# Altium project Concentrador-Modbus.PrjPcb (part 2 of 3)
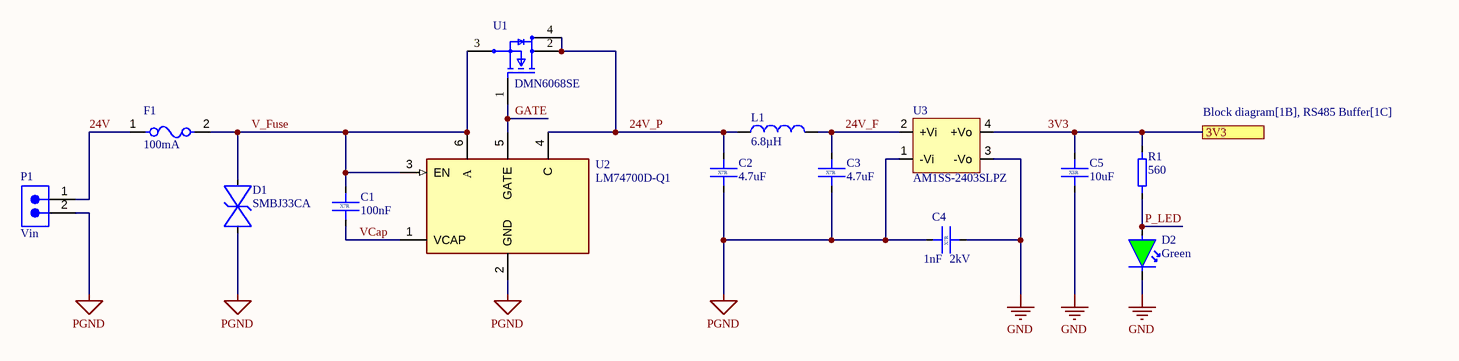
[diagram p3: PSU.SchDoc]

## Sheet PSU.SchDoc: POWER SUPPLY (continued)
### Library data of the parts
C1 = 06035C104JAT2A: 0603 100 nF 50 V ±5 % Tolerance X7R SMT MLCC; Manufacturer: KYOCERA AVX; Dielectric Material: Ceramic; Tolerance: 5%; Voltage: 50V; Supplier: TME; Supplier Part Number: 06035C104JAT2A; Manufacturer Part Number: 06035C104JAT2A; RoHS: Compliant; Category: Ceramic Capacitors; Stock: 65414; Pricing: 1=0,02486, 10=0,02212, 100=0,0145, 500=0,00951, 1000=0,00801, 4000=0,00598, 8000=0,00531, 12000=0,005, 20000=0,00468, 40000=0,00453 (EUR); Value: 100nF; Case/Package: 0603; Case Code (Imperial): 0603; Case Code (Metric): 1608; China RoHS: Compliant; Contact Plating: Tin; Depth: 810µm; Height: 940µm; Lead Free: Lead Free; Length: 1.6mm; Lifecycle Status: Production; Material: Ceramic; Max Operating Temperature: 125°C; Min Operating Temperature: -55°C; Mounting Technology: Surface Mount; Pins: 2; Number of Terminals: 2; Packaging: Cut Tape; Radiation Hardening: No; REACH SVHC: Yes; Schedule B: 8532240020; Termination: SMD/SMT; Thickness: 889µm; Voltage Rating: 50V; Voltage Rating (DC): 50V; Width: 810µm; ComponentLink1URL: https://datasheet.octopart.com:443/06035C104JAT2A-KYOCERA-AVX-datasheet-170560559.pdf?src-supplier=IHS; ComponentLink1Description: https://datasheet.octopart.com:443/06035C104JAT2A-KYOCERA-AVX-datasheet-170560559.pdf?src-supplier=IHS; ComponentLink2URL: https://datasheet.octopart.com:443/06035C104JAT2A-AVX-datasheet-26446220.pdf?src-supplier=Upverter; ComponentLink2Description: https://datasheet.octopart.com:443/06035C104JAT2A-AVX-datasheet-26446220.pdf?src-supplier=Upverter; ComponentLink3URL: https://sigma.octopart.com:443/147443767/technical_drawing/AVX-06035C104JAT2A.pdf?src-supplier=Upverter; ComponentLink3Description: https://sigma.octopart.com:443/147443767/technical_drawing/AVX-06035C104JAT2A.pdf?src-supplier=Upverter; ComponentLink4URL: https://datasheet.octopart.com:443/06035C104JAT2A-AVX-datasheet-12587061.pdf?src-supplier=element14+APAC; ComponentLink4Description: https://datasheet.octopart.com:443/06035C104JAT2A-AVX-datasheet-12587061.pdf?src-supplier=element14+APAC; ComponentLink5URL: https://datasheet.octopart.com:443/06035C104JAT2A-AVX-datasheet-12509786.pdf?src-supplier=element14+APAC; ComponentLink5Description: https://datasheet.octopart.com:443/06035C104JAT2A-AVX-datasheet-12509786.pdf?src-supplier=element14+APAC; ComponentLink6URL: https://datasheet.octopart.com:443/06035C104JAT2A-KYOCERA-AVX-datasheet-158983632.pdf?src-supplier=Newark; ComponentLink6Description: https://datasheet.octopart.com:443/06035C104JAT2A-KYOCERA-AVX-datasheet-158983632.pdf?src-supplier=Newark; ComponentLink7URL: https://datasheet.octopart.com:443/06035C104JAT2A-AVX-datasheet-78690206.pdf?src-supplier=Newark; ComponentLink7Description: https://datasheet.octopart.com:443/06035C104JAT2A-AVX-datasheet-78690206.pdf?src-supplier=Newark; ComponentLink8URL: https://datasheet.octopart.com:443/06035C104JAT2A-KYOCERA-AVX-datasheet-65931687.pdf?src-supplier=Newark; ComponentLink8Description: https://datasheet.octopart.com:443/06035C104JAT2A-KYOCERA-AVX-datasheet-65931687.pdf?src-supplier=Newark; ComponentLink9URL: https://datasheet.octopart.com:443/06035C104JAT2A-AVX-datasheet-8113618.pdf?src-supplier=Factory+Futures; ComponentLink9Description: https://datasheet.octopart.com:443/06035C104JAT2A-AVX-datasheet-8113618.pdf?src-supplier=Factory+Futures; ComponentLink10URL: https://datasheet.octopart.com:443/06035C104JAT2A-AVX-datasheet-5313617.pdf?src-supplier=Factory+Futures; ComponentLink10Description: https://datasheet.octopart.com:443/06035C104JAT2A-AVX-datasheet-5313617.pdf?src-supplier=Factory+Futures; ComponentLink11URL: https://datasheet.octopart.com:443/06035C104JAT2A-AVX-datasheet-167033.pdf?src-supplier=Factory+Futures; ComponentLink11Description: https://datasheet.octopart.com:443/06035C104JAT2A-AVX-datasheet-167033.pdf?src-supplier=Factory+Futures; ComponentLink12URL: https://datasheet.octopart.com:443/06035C104JAT2A-AVX-datasheet-166051239.pdf?src-supplier=Amar+Radio+Corporation; ComponentLink12Description: https://datasheet.octopart.com:443/06035C104JAT2A-AVX-datasheet-166051239.pdf?src-supplier=Amar+Radio+Corporation; ComponentLink13URL: https://datasheet.octopart.com:443/06035C104JAT2A-KYOCERA-AVX-datasheet-156093841.pdf?src-supplier=TME; ComponentLink13Description: https://datasheet.octopart.com:443/06035C104JAT2A-KYOCERA-AVX-datasheet-156093841.pdf?src-supplier=TME; ComponentLink14URL: https://datasheet.octopart.com:443/06035C104JAT2A-AVX---Kyocera-datasheet-8446237.pdf?src-supplier=TME; ComponentLink14Description: https://datasheet.octopart.com:443/06035C104JAT2A-AVX---Kyocera-datasheet-8446237.pdf?src-supplier=TME; ComponentLink15URL: https://datasheet.octopart.com:443/06035C104JAT2A-KYOCERA-AVX-datasheet-50865067.pdf?src-supplier=Future+Electronics; ComponentLink15Description: https://datasheet.octopart.com:443/06035C104JAT2A-KYOCERA-AVX-datasheet-50865067.pdf?src-supplier=Future+Electronics; ComponentLink16URL: https://datasheet.octopart.com/06035C104JAT2A-AVX---Kyocera-datasheet-13516023.pdf; ComponentLink16Description: https://datasheet.octopart.com/06035C104JAT2A-AVX---Kyocera-datasheet-13516023.pdf; ComponentLink17URL: https://datasheet.octopart.com:443/06035C104JAT2A-AVX-datasheet-11546901.pdf?src-supplier=Arrow+Electronics; ComponentLink17Description: https://datasheet.octopart.com:443/06035C104JAT2A-AVX-datasheet-11546901.pdf?src-supplier=Arrow+Electronics; ComponentLink18URL: https://datasheet.octopart.com:443/06035C104JAT2A-AVX-datasheet-4352.pdf?src-supplier=RS+(Formerly+Allied+Electronics); ComponentLink18Description: https://datasheet.octopart.com:443/06035C104JAT2A-AVX-datasheet-4352.pdf?src-supplier=RS+(Formerly+Allied+Electronics); ComponentLink19URL: http://sigma.octopart.com:80/reach_statement/AVX-company-19.pdf?src-supplier=Compliance+Statements; ComponentLink19Description: http://sigma.octopart.com:80/reach_statement/AVX-company-19.pdf?src-supplier=Compliance+Statements; ComponentLink20URL: http://sigma.octopart.com:80/conflict_mineral_statement/AVX-company-34.pdf?src-supplier=Compliance+Statements; ComponentLink20Description: http://sigma.octopart.com:80/conflict_mineral_statement/AVX-company-34.pdf?src-supplier=Compliance+Statements
C2 C3 = 12065C475K4Z2A: 1206 4.7 uF 50 V ±10 % Tolerance X7R SMT MLCC; Manufacturer: KYOCERA AVX; Dielectric Material: Ceramic; Tolerance: 10%; Voltage Rating: 50V; Supplier: TME; Supplier Part Number: 12065C475K4Z2A; Manufacturer Part Number: 12065C475K4Z2A; RoHS: Compliant; Category: Ceramic Capacitors; Stock: 2656; Pricing: 1=0,426, 10=0,253, 100=0,206, 500=0,152, 1000=0,131, 2000=0,12, 4000=0,117, 6000=0,114, 10000=0,113 (EUR); Value: 4.7uF; Case/Package: 1206; China RoHS: Compliant; Height: 1.78mm; Length: 3.2mm; Lifecycle Status: Production; Material: Ceramic; Max Operating Temperature: 125°C; Min Operating Temperature: -55°C; Mounting Technology: Surface Mount; Number of Terminals: 2; REACH SVHC: Yes; Schedule B: 8532240020; Voltage Rating (DC): 50V; Width: 1.6mm; ComponentLink1URL: https://datasheet.octopart.com:443/12065C475K4Z2A-KYOCERA-AVX-datasheet-172544266.pdf?src-supplier=IHS; ComponentLink1Description: https://datasheet.octopart.com:443/12065C475K4Z2A-KYOCERA-AVX-datasheet-172544266.pdf?src-supplier=IHS; ComponentLink2URL: https://datasheet.octopart.com:443/12065C475K4Z2A-KYOCERA-AVX-datasheet-170607686.pdf?src-supplier=Newark; ComponentLink2Description: https://datasheet.octopart.com:443/12065C475K4Z2A-KYOCERA-AVX-datasheet-170607686.pdf?src-supplier=Newark; ComponentLink3URL: https://datasheet.octopart.com:443/12065C475K4Z2A-KYOCERA-AVX-datasheet-101604984.pdf?src-supplier=Farnell; ComponentLink3Description: https://datasheet.octopart.com:443/12065C475K4Z2A-KYOCERA-AVX-datasheet-101604984.pdf?src-supplier=Farnell; ComponentLink4URL: https://datasheet.octopart.com:443/12065C475K4Z2A-KYOCERA-AVX-datasheet-156093842.pdf?src-supplier=Future+Electronics; ComponentLink4Description: https://datasheet.octopart.com:443/12065C475K4Z2A-KYOCERA-AVX-datasheet-156093842.pdf?src-supplier=Future+Electronics; ComponentLink5URL: https://datasheet.octopart.com:443/12065C475K4Z2A-KYOCERA-AVX-datasheet-156093841.pdf?src-supplier=TME; ComponentLink5Description: https://datasheet.octopart.com:443/12065C475K4Z2A-KYOCERA-AVX-datasheet-156093841.pdf?src-supplier=TME; ComponentLink6URL: https://datasheet.octopart.com:443/12065C475K4Z2A-AVX-datasheet-151020609.pdf?src-supplier=LKR; ComponentLink6Description: https://datasheet.octopart.com:443/12065C475K4Z2A-AVX-datasheet-151020609.pdf?src-supplier=LKR; ComponentLink7URL: https://datasheet.octopart.com/12065C475K4Z2A-KYOCERA-AVX-datasheet-13516023.pdf; ComponentLink7Description: https://datasheet.octopart.com/12065C475K4Z2A-KYOCERA-AVX-datasheet-13516023.pdf; ComponentLink8URL: http://sigma.octopart.com:80/reach_statement/AVX-company-19.pdf?src-supplier=Compliance+Statements; ComponentLink8Description: http://sigma.octopart.com:80/reach_statement/AVX-company-19.pdf?src-supplier=Compliance+Statements; ComponentLink9URL: http://sigma.octopart.com:80/conflict_mineral_statement/AVX-company-34.pdf?src-supplier=Compliance+Statements; ComponentLink9Description: http://sigma.octopart.com:80/conflict_mineral_statement/AVX-company-34.pdf?src-supplier=Compliance+Statements
C4 = CC1206KKX7RDBB102: 1210 1 nF 2 kV ±10 % Tolerance X7R SMT MLCC; Manufacturer: Yageo Group; Dielectric Material: Ceramic; Dissipation Factor: 2.5%; Insulation Resistance: 10GΩ; Tolerance: 10%; Supplier: TME; Supplier Part Number: CC1206KKX7RDBB102; Manufacturer Part Number: CC1206KKX7RDBB102; RoHS: Compliant; Category: Ceramic Capacitors; Stock: 17400; Pricing: 1=0,1, 10=0,0533, 50=0,0349, 100=0,0259, 500=0,0199, 1000=0,0185, 3000=0,0179, 6000=0,0175, 9000=0,0172, 15000=0,0169 (EUR); Value: 1nF; Case/Package: 1206; Case Code (Imperial): 1206; Case Code (Metric): 3216; China RoHS: Compliant; Composition: Ceramic; Depth: 1.6mm; Height: 1.25mm; Lead Free: Lead Free; Length: 3.2mm; Lifecycle Status: Production; Material: Ceramic; Max Operating Temperature: 125°C; Min Operating Temperature: -55°C; Mounting Technology: Surface Mount; Pins: 2; Number of Terminals: 2; Radiation Hardening: No; REACH SVHC: Unaffected; Schedule B: 8532240020, 8532240020|8532240020|8532240020|8532240020|8532240020|8532240020|8532240020|8532240020|8532240020|8532240020|8532240020|8532240020|8532240020|8532240020|8532240020|8532240020|8532240020|8532240020|8532240020|8532240020|8532240020|8532240020|8532240020|85; Termination: SMD/SMT; Thickness: 1.4478mm; Voltage Rating: 2kV; Voltage Rating (DC): 2kV; Width: 1.6mm; ComponentLink1URL: https://datasheet.octopart.com:443/CC1206KKX7RDBB102-Yageo-datasheet-182140686.pdf?src-supplier=IHS; ComponentLink1Description: https://datasheet.octopart.com:443/CC1206KKX7RDBB102-Yageo-datasheet-182140686.pdf?src-supplier=IHS; ComponentLink2URL: https://datasheet.octopart.com:443/CC1206KKX7RDBB102-Yageo-datasheet-151869847.pdf?src-supplier=Upverter; ComponentLink2Description: https://datasheet.octopart.com:443/CC1206KKX7RDBB102-Yageo-datasheet-151869847.pdf?src-supplier=Upverter; ComponentLink3URL: https://sigma.octopart.com:443/147830939/technical_drawing/Yageo-CC1206KKX7RDBB102.pdf?src-supplier=Upverter; ComponentLink3Description: https://sigma.octopart.com:443/147830939/technical_drawing/Yageo-CC1206KKX7RDBB102.pdf?src-supplier=Upverter; ComponentLink4URL: https://datasheet.octopart.com:443/CC1206KKX7RDBB102-Yageo-datasheet-49299170.pdf?src-supplier=element14+APAC; ComponentLink4Description: https://datasheet.octopart.com:443/CC1206KKX7RDBB102-Yageo-datasheet-49299170.pdf?src-supplier=element14+APAC; ComponentLink5URL: https://datasheet.octopart.com:443/CC1206KKX7RDBB102-Yageo-datasheet-13436831.pdf?src-supplier=element14+APAC; ComponentLink5Description: https://datasheet.octopart.com:443/CC1206KKX7RDBB102-Yageo-datasheet-13436831.pdf?src-supplier=element14+APAC; ComponentLink6URL: https://datasheet.octopart.com:443/CC1206KKX7RDBB102-Yageo-datasheet-181970793.pdf?src-supplier=Newark; ComponentLink6Description: https://datasheet.octopart.com:443/CC1206KKX7RDBB102-Yageo-datasheet-181970793.pdf?src-supplier=Newark; ComponentLink7URL: https://datasheet.octopart.com:443/CC1206KKX7RDBB102-Yageo-datasheet-181970792.pdf?src-supplier=Newark; ComponentLink7Description: https://datasheet.octopart.com:443/CC1206KKX7RDBB102-Yageo-datasheet-181970792.pdf?src-supplier=Newark; ComponentLink8URL: https://datasheet.octopart.com:443/CC1206KKX7RDBB102-Yageo-datasheet-11521487.pdf?src-supplier=Newark; ComponentLink8Description: https://datasheet.octopart.com:443/CC1206KKX7RDBB102-Yageo-datasheet-11521487.pdf?src-supplier=Newark; ComponentLink9URL: https://datasheet.octopart.com:443/CC1206KKX7RDBB102-Yageo-datasheet-8324504.pdf?src-supplier=Newark; ComponentLink9Description: https://datasheet.octopart.com:443/CC1206KKX7RDBB102-Yageo-datasheet-8324504.pdf?src-supplier=Newark; ComponentLink10URL: https://datasheet.octopart.com:443/CC1206KKX7RDBB102-Yageo-datasheet-159543404.pdf?src-supplier=Newark; ComponentLink10Description: https://datasheet.octopart.com:443/CC1206KKX7RDBB102-Yageo-datasheet-159543404.pdf?src-supplier=Newark; ComponentLink11URL: https://datasheet.octopart.com:443/CC1206KKX7RDBB102-Yageo-Group-datasheet-192360828.pdf?src-supplier=Future+Electronics; ComponentLink11Description: https://datasheet.octopart.com:443/CC1206KKX7RDBB102-Yageo-Group-datasheet-192360828.pdf?src-supplier=Future+Electronics; ComponentLink12URL: https://datasheet.octopart.com:443/CC1206KKX7RDBB102-Yageo-datasheet-169726300.pdf?src-supplier=Future+Electronics; ComponentLink12Description: https://datasheet.octopart.com:443/CC1206KKX7RDBB102-Yageo-datasheet-169726300.pdf?src-supplier=Future+Electronics; ComponentLink13URL: https://datasheet.octopart.com:443/CC1206KKX7RDBB102-Yageo-datasheet-137700082.pdf?src-supplier=Future+Electronics; ComponentLink13Description: https://datasheet.octopart.com:443/CC1206KKX7RDBB102-Yageo-datasheet-137700082.pdf?src-supplier=Future+Electronics; ComponentLink14URL: https://datasheet.octopart.com:443/CC1206KKX7RDBB102-Yageo-datasheet-137700086.pdf?src-supplier=Future+Electronics; ComponentLink14Description: https://datasheet.octopart.com:443/CC1206KKX7RDBB102-Yageo-datasheet-137700086.pdf?src-supplier=Future+Electronics; ComponentLink15URL: https://datasheet.octopart.com:443/CC1206KKX7RDBB102-Yageo-datasheet-137700084.pdf?src-supplier=Future+Electronics; ComponentLink15Description: https://datasheet.octopart.com:443/CC1206KKX7RDBB102-Yageo-datasheet-137700084.pdf?src-supplier=Future+Electronics; ComponentLink16URL: https://datasheet.octopart.com:443/CC1206KKX7RDBB102-Yageo-datasheet-26579250.pdf?src-supplier=Future+Electronics; ComponentLink16Description: https://datasheet.octopart.com:443/CC1206KKX7RDBB102-Yageo-datasheet-26579250.pdf?src-supplier=Future+Electronics; ComponentLink17URL: https://datasheet.octopart.com:443/CC1206KKX7RDBB102-Yageo-Group-datasheet-194267568.pdf?src-supplier=LCSC; ComponentLink17Description: https://datasheet.octopart.com:443/CC1206KKX7RDBB102-Yageo-Group-datasheet-194267568.pdf?src-supplier=LCSC; ComponentLink18URL: https://datasheet.octopart.com:443/CC1206KKX7RDBB102-Yageo-datasheet-151948686.pdf?src-supplier=TME; ComponentLink18Description: https://datasheet.octopart.com:443/CC1206KKX7RDBB102-Yageo-datasheet-151948686.pdf?src-supplier=TME; ComponentLink19URL: https://datasheet.octopart.com:443/CC1206KKX7RDBB102-Yageo-datasheet-17600895.pdf?src-supplier=TME; ComponentLink19Description: https://datasheet.octopart.com:443/CC1206KKX7RDBB102-Yageo-datasheet-17600895.pdf?src-supplier=TME; ComponentLink20URL: https://datasheet.octopart.com:443/CC1206KKX7RDBB102-Yageo-datasheet-11518992.pdf?src-supplier=Farnell; ComponentLink20Description: https://datasheet.octopart.com:443/CC1206KKX7RDBB102-Yageo-datasheet-11518992.pdf?src-supplier=Farnell; ComponentLink21URL: https://datasheet.octopart.com:443/CC1206KKX7RDBB102-Yageo-datasheet-10883670.pdf?src-supplier=Farnell; ComponentLink21Description: https://datasheet.octopart.com:443/CC1206KKX7RDBB102-Yageo-datasheet-10883670.pdf?src-supplier=Farnell; ComponentLink22URL: http://sigma.octopart.com:80/conflict_mineral_statement/Yageo-company-3.pdf?src-supplier=Compliance+Statements; ComponentLink22Description: http://sigma.octopart.com:80/conflict_mineral_statement/Yageo-company-3.pdf?src-supplier=Compliance+Statements; ComponentLink23URL: http://sigma.octopart.com:80/rohs_statement/Yageo-company-2.pdf?src-supplier=Compliance+Statements; ComponentLink23Description: http://sigma.octopart.com:80/rohs_statement/Yageo-company-2.pdf?src-supplier=Compliance+Statements
C5 = 08053D106KAT2A: 0805 10 uF 25 V ±10 % Tolerance X5R SMT MLCC; Manufacturer: KYOCERA AVX; Dielectric Material: Ceramic; Tolerance: 10%; Voltage Rating: 25V; Supplier: TME; Supplier Part Number: 08053D106KAT2A; Manufacturer Part Number: 08053D106KAT2A; RoHS: Compliant; Category: Ceramic Capacitors; Stock: 23; Pricing: 1=0,1789, 10=0,0986, 50=0,0563, 100=0,0482, 500=0,0372, 1000=0,0342, 3000=0,032, 6000=0,0311, 9000=0,0307, 15000=0,0304 (EUR); Value: 10uF; Case/Package: 0805; Case Code (Imperial): 0805; Case Code (Metric): 2012; China RoHS: Compliant; Contact Plating: Tin; Depth: 1.25mm; Height: 1.52mm; Lead Free: Lead Free; Length: 2.01mm; Lifecycle Status: Production; Material: Ceramic; Max Operating Temperature: 85°C; Min Operating Temperature: -55°C; Mounting Technology: Surface Mount; Pins: 2; Number of Terminals: 2; Packaging: Cut Tape; Radiation Hardening: No; REACH SVHC: Yes; Schedule B: 8532240020; Termination: SMD/SMT; Thickness: 1.2954mm; Voltage Rating (DC): 25V; Width: 1.25mm; ComponentLink1URL: https://datasheet.octopart.com:443/08053D106KAT2A-KYOCERA-AVX-datasheet-165873359.pdf?src-supplier=IHS; ComponentLink1Description: https://datasheet.octopart.com:443/08053D106KAT2A-KYOCERA-AVX-datasheet-165873359.pdf?src-supplier=IHS; ComponentLink2URL: https://datasheet.octopart.com:443/08053D106KAT2A-KYOCERA-AVX-datasheet-50865064.pdf?src-supplier=Upverter; ComponentLink2Description: https://datasheet.octopart.com:443/08053D106KAT2A-KYOCERA-AVX-datasheet-50865064.pdf?src-supplier=Upverter; ComponentLink3URL: https://sigma.octopart.com:443/147443767/technical_drawing/AVX-08053D106KAT2A.pdf?src-supplier=Upverter; ComponentLink3Description: https://sigma.octopart.com:443/147443767/technical_drawing/AVX-08053D106KAT2A.pdf?src-supplier=Upverter; ComponentLink4URL: https://sigma.octopart.com:443/138895656/technical_drawing/AVX-08053D106KAT2A.pdf?src-supplier=Upverter; ComponentLink4Description: https://sigma.octopart.com:443/138895656/technical_drawing/AVX-08053D106KAT2A.pdf?src-supplier=Upverter; ComponentLink5URL: https://datasheet.octopart.com:443/08053D106KAT2A-AVX-datasheet-12340990.pdf?src-supplier=Future+Electronics; ComponentLink5Description: https://datasheet.octopart.com:443/08053D106KAT2A-AVX-datasheet-12340990.pdf?src-supplier=Future+Electronics; ComponentLink6URL: https://datasheet.octopart.com:443/08053D106KAT2A-AVX-datasheet-8448153.pdf?src-supplier=Future+Electronics; ComponentLink6Description: https://datasheet.octopart.com:443/08053D106KAT2A-AVX-datasheet-8448153.pdf?src-supplier=Future+Electronics; ComponentLink7URL: https://datasheet.octopart.com:443/08053D106KAT2A-AVX-datasheet-5314571.pdf?src-supplier=Future+Electronics; ComponentLink7Description: https://datasheet.octopart.com:443/08053D106KAT2A-AVX-datasheet-5314571.pdf?src-supplier=Future+Electronics; ComponentLink8URL: https://datasheet.octopart.com:443/08053D106KAT2A-KYOCERA-AVX-datasheet-78690022.pdf?src-supplier=element14+APAC; ComponentLink8Description: https://datasheet.octopart.com:443/08053D106KAT2A-KYOCERA-AVX-datasheet-78690022.pdf?src-supplier=element14+APAC; ComponentLink9URL: https://datasheet.octopart.com:443/08053D106KAT2A-AVX-datasheet-65931686.pdf?src-supplier=element14+APAC; ComponentLink9Description: https://datasheet.octopart.com:443/08053D106KAT2A-AVX-datasheet-65931686.pdf?src-supplier=element14+APAC; ComponentLink10URL: https://datasheet.octopart.com:443/08053D106KAT2A-AVX-datasheet-10029314.pdf?src-supplier=Newark; ComponentLink10Description: https://datasheet.octopart.com:443/08053D106KAT2A-AVX-datasheet-10029314.pdf?src-supplier=Newark; ComponentLink11URL: https://datasheet.octopart.com:443/08053D106KAT2A-AVX-datasheet-26443659.pdf?src-supplier=Newark; ComponentLink11Description: https://datasheet.octopart.com:443/08053D106KAT2A-AVX-datasheet-26443659.pdf?src-supplier=Newark; ComponentLink12URL: https://datasheet.octopart.com:443/08053D106KAT2A-AVX-datasheet-166051239.pdf?src-supplier=Amar+Radio+Corporation; ComponentLink12Description: https://datasheet.octopart.com:443/08053D106KAT2A-AVX-datasheet-166051239.pdf?src-supplier=Amar+Radio+Corporation; ComponentLink13URL: https://datasheet.octopart.com:443/08053D106KAT2A-KYOCERA-AVX-datasheet-158983636.pdf?src-supplier=Farnell; ComponentLink13Description: https://datasheet.octopart.com:443/08053D106KAT2A-KYOCERA-AVX-datasheet-158983636.pdf?src-supplier=Farnell; ComponentLink14URL: https://datasheet.octopart.com:443/08053D106KAT2A-AVX-datasheet-10978697.pdf?src-supplier=Farnell; ComponentLink14Description: https://datasheet.octopart.com:443/08053D106KAT2A-AVX-datasheet-10978697.pdf?src-supplier=Farnell; ComponentLink15URL: https://datasheet.octopart.com:443/08053D106KAT2A-KYOCERA-AVX-datasheet-155912759.pdf?src-supplier=TME; ComponentLink15Description: https://datasheet.octopart.com:443/08053D106KAT2A-KYOCERA-AVX-datasheet-155912759.pdf?src-supplier=TME; ComponentLink16URL: https://datasheet.octopart.com:443/08053D106KAT2A-AVX-datasheet-52.pdf?src-supplier=TME; ComponentLink16Description: https://datasheet.octopart.com:443/08053D106KAT2A-AVX-datasheet-52.pdf?src-supplier=TME; ComponentLink17URL: https://datasheet.octopart.com/08053D106KAT2A-AVX---Kyocera-datasheet-13516023.pdf; ComponentLink17Description: https://datasheet.octopart.com/08053D106KAT2A-AVX---Kyocera-datasheet-13516023.pdf; ComponentLink18URL: http://sigma.octopart.com:80/conflict_mineral_statement/AVX-company-34.pdf?src-supplier=Compliance+Statements; ComponentLink18Description: http://sigma.octopart.com:80/conflict_mineral_statement/AVX-company-34.pdf?src-supplier=Compliance+Statements; ComponentLink19URL: http://sigma.octopart.com:80/reach_statement/AVX-company-19.pdf?src-supplier=Compliance+Statements; ComponentLink19Description: http://sigma.octopart.com:80/reach_statement/AVX-company-19.pdf?src-supplier=Compliance+Statements; Supplier 1: TME; Supplier Part Number 1: 08053D106KAT2A
D1 = SMBJ33CA: SMBJ33A Series 600 W 33 V Surface Mount Bi-Directional TVS Diode - DO-214AA; Manufacturer: Littelfuse; Breakdown Voltage: 39.45V; Value: 800pF; Clamping Voltage: 53.3V; Direction: Bidirectional; Element Configuration: Single; ESD Protection: No; Leakage Current: 5µA; Max Breakdown Voltage: 42.2V; Max Junction Temperature (Tj): 150°C; Max Output current: 11.3A; Max Power Dissipation: 5W; Min Breakdown Voltage: 36.7V; Number of Bidirectional Channels: 1; Peak Pulse Power: 600W; Reverse Standoff Voltage: 33V; Test Current: 1mA; Manufacturer Part Number: SMBJ33CA; LCSC: C83325; RoHS: YES; Supplier: TME; Supplier Part Number: SMBJ33CA-13-F; Category: TVS Diodes; Stock: 3861; Pricing: 1=0,191, 5=0,157, 10=0,143, 100=0,104, 500=0,086, 1000=0,079, 3000=0,076 (EUR); Case/Package: SMB; China RoHS: Non-Compliant; Composition: Zener; Contact Plating: Tin; Height: 2.5mm; Lead Free: Lead Free; Length: 4.57mm; Lifecycle Status: Production; Max Operating Temperature: 150°C; Max Reverse Leakage Current: 5µA; Max Surge Current: 11.3A; Min Operating Temperature: -55°C; Mounting Technology: Surface Mount; Number of Channels: 1; Number of Elements: 1; Pins: 2; Number of Terminals: 2; Packaging: Cut Tape; Peak Pulse Current: 11.3A; Polarity: Bidirectional; Power Dissipation: 600W; Power Line Protection: No; Power Rating: 600W; Radiation Hardening: No; REACH SVHC: No; Reverse Breakdown Voltage: 36.7V; Schedule B: 8541100050, 8541100050|8541100050, 8541100050|8541100050|8541100050, 8541100050|8541100050|8541100050|8541100050; Termination: SMD/SMT; Voltage Rating (DC): 33V; Width: 3.9mm; Working Voltage: 33V; ComponentLink1URL: https://sigma.octopart.com:443/138895986/technical_drawing/Diodes-Inc.-SMBJ33CA-13-F.pdf?src-supplier=Diodes+Inc+SCT; ComponentLink1Description: https://sigma.octopart.com:443/138895986/technical_drawing/Diodes-Inc.-SMBJ33CA-13-F.pdf?src-supplier=Diodes+Inc+SCT; ComponentLink2URL: https://datasheet.octopart.com:443/SMBJ33CA-13-F-Diodes-Inc.-datasheet-103923734.pdf?src-supplier=IHS; ComponentLink2Description: https://datasheet.octopart.com:443/SMBJ33CA-13-F-Diodes-Inc.-datasheet-103923734.pdf?src-supplier=IHS; ComponentLink3URL: https://datasheet.octopart.com/SMBJ33CA-13-F-Diodes-Inc.-datasheet-8324228.pdf; ComponentLink3Description: https://datasheet.octopart.com/SMBJ33CA-13-F-Diodes-Inc.-datasheet-8324228.pdf; ComponentLink4URL: https://datasheet.octopart.com/SMBJ33CA-13-F-Diodes-Inc.-datasheet-5315511.pdf; ComponentLink4Description: https://datasheet.octopart.com/SMBJ33CA-13-F-Diodes-Inc.-datasheet-5315511.pdf; ComponentLink5URL: https://datasheet.octopart.com:443/SMBJ33CA-13-F-Diodes-Inc.-datasheet-127821667.pdf?src-supplier=TME; ComponentLink5Description: https://datasheet.octopart.com:443/SMBJ33CA-13-F-Diodes-Inc.-datasheet-127821667.pdf?src-supplier=TME; ComponentLink6URL: https://datasheet.octopart.com:443/SMBJ33CA-13-F-Diodes-Inc.-datasheet-14047828.pdf?src-supplier=iiiC; ComponentLink6Description: https://datasheet.octopart.com:443/SMBJ33CA-13-F-Diodes-Inc.-datasheet-14047828.pdf?src-supplier=iiiC; ComponentLink7URL: https://datasheet.octopart.com:443/SMBJ33CA-13-F-Diodes-Inc.-datasheet-120133.pdf?src-supplier=DigiKey; ComponentLink7Description: https://datasheet.octopart.com:443/SMBJ33CA-13-F-Diodes-Inc.-datasheet-120133.pdf?src-supplier=DigiKey
D2 = LTST-C190KGKT: Single-color LEDs; LITEON; LTST-C190KGKT; Green; 130 °; 2.4 V; 0603; Manufacturer: Vishay Lite-On; Dominant Wavelength: 571nm; Forward Current: 30mA; Forward Voltage: 2.4V; Lens Color: Clear, Colorless; Lens Style: Clear; Luminous Intensity: 35mcd; Number of Circuits: 1; Peak Wavelength: 574nm; Power Dissipation: 75mW; Reverse Voltage: 5V; Shape: Rectangular; Test Current: 20mA; Viewing Angle: 130°; Manufacturer Part Number: LTST-C190KGKT; RoHS: YES; Supplier 1: Rs; Supplier Part Number 1: 6920988P; Supplier: TME; Supplier Part Number: LTST-C190KGKT; Category: LEDs; Stock: 84585; Pricing: 1=0,04, 100=0,0354, 500=0,0304, 2000=0,0263, 4000=0,0244, 8000=0,0224, 12000=0,0213, 20000=0,0199, 28000=0,019, 100000=0,0158 (EUR); Case/Package: 0603; Case Code (Imperial): 0603; Case Code (Metric): 1608; China RoHS: Compliant; Color: Green; Depth: 800µm; Height: 800µm; Illumination Color: Green; Lead Free: Lead Free; Length: 1.6mm; Lens Transparency: Clear; Lifecycle Status: Production; Max Operating Temperature: 85°C; Min Operating Temperature: -30°C; Mounting Technology: Surface Mount; Number of Elements: 1; Number of LEDs: 1; Pins: 2; Number of Terminals: 2; Power Rating: 75mW; Radiation Hardening: No; REACH SVHC: Yes; Schedule B: 8541402000, 8541402000|8541402000|8541402000|8541402000|8541402000|8541402000|8541402000|8541402000|8541402000|8541402000|8541402000|8541402000|8541402000|8541402000|8541402000|8541402000|8541402000|8541402000|8541402000|8541402000|8541402000|8541402000|8541402000|85; Terminal Pitch: 1.5mm; Wavelength: 574nm; Width: 800µm; ComponentLink1URL: https://datasheet.octopart.com:443/LTST-C190KGKT-Lite-On-datasheet-86397316.pdf?src-supplier=ODG+(Origin+Data+Global); ComponentLink1Description: https://datasheet.octopart.com:443/LTST-C190KGKT-Lite-On-datasheet-86397316.pdf?src-supplier=ODG+(Origin+Data+Global); ComponentLink2URL: https://datasheet.octopart.com:443/LTST-C190KGKT-Lite-On-datasheet-180605179.pdf?src-supplier=IHS; ComponentLink2Description: https://datasheet.octopart.com:443/LTST-C190KGKT-Lite-On-datasheet-180605179.pdf?src-supplier=IHS; ComponentLink3URL: https://datasheet.octopart.com:443/LTST-C190KGKT-Lite-On-datasheet-13693967.pdf?src-supplier=Factory+Futures; ComponentLink3Description: https://datasheet.octopart.com:443/LTST-C190KGKT-Lite-On-datasheet-13693967.pdf?src-supplier=Factory+Futures; ComponentLink4URL: https://datasheet.octopart.com:443/LTST-C190KGKT-Lite-On-datasheet-165573809.pdf?src-supplier=TME; ComponentLink4Description: https://datasheet.octopart.com:443/LTST-C190KGKT-Lite-On-datasheet-165573809.pdf?src-supplier=TME; ComponentLink5URL: https://datasheet.octopart.com:443/LTST-C190KGKT-Lite-On-datasheet-165573808.pdf?src-supplier=TME; ComponentLink5Description: https://datasheet.octopart.com:443/LTST-C190KGKT-Lite-On-datasheet-165573808.pdf?src-supplier=TME; ComponentLink6URL: https://datasheet.octopart.com:443/LTST-C190KGKT-Lite-On-datasheet-43775815.pdf?src-supplier=TME; ComponentLink6Description: https://datasheet.octopart.com:443/LTST-C190KGKT-Lite-On-datasheet-43775815.pdf?src-supplier=TME; ComponentLink7URL: https://datasheet.octopart.com:443/LTST-C190KGKT-Lite-On-datasheet-32046999.pdf?src-supplier=Future+Electronics; ComponentLink7Description: https://datasheet.octopart.com:443/LTST-C190KGKT-Lite-On-datasheet-32046999.pdf?src-supplier=Future+Electronics; ComponentLink8URL: https://datasheet.octopart.com:443/LTST-C190KGKT-Lite-On-datasheet-8326678.pdf?src-supplier=Future+Electronics; ComponentLink8Description: https://datasheet.octopart.com:443/LTST-C190KGKT-Lite-On-datasheet-8326678.pdf?src-supplier=Future+Electronics; ComponentLink9URL: https://datasheet.octopart.com:443/LTST-C190KGKT-Lite-On-datasheet-78838574.pdf?src-supplier=Future+Electronics; ComponentLink9Description: https://datasheet.octopart.com:443/LTST-C190KGKT-Lite-On-datasheet-78838574.pdf?src-supplier=Future+Electronics; ComponentLink10URL: https://datasheet.octopart.com:443/LTST-C190KGKT-Lite-On-datasheet-158288.pdf?src-supplier=Mouser; ComponentLink10Description: https://datasheet.octopart.com:443/LTST-C190KGKT-Lite-On-datasheet-158288.pdf?src-supplier=Mouser; ComponentLink11URL: https://datasheet.octopart.com:443/LTST-C190KGKT-Lite-On-datasheet-49281.pdf?src-supplier=DigiKey; ComponentLink11Description: https://datasheet.octopart.com:443/LTST-C190KGKT-Lite-On-datasheet-49281.pdf?src-supplier=DigiKey; ComponentLink12URL: https://datasheet.octopart.com:443/LTST-C190KGKT-Lite-On-datasheet-14174998.pdf?src-supplier=iiiC; ComponentLink12Description: https://datasheet.octopart.com:443/LTST-C190KGKT-Lite-On-datasheet-14174998.pdf?src-supplier=iiiC
F1 = MF-MSMF010-2: PTC Resettable Fuse 0.1A(hold) 0.3A(trip) 60V 40A 0.8W 1.5s 0.7Ohm SMD Solder Pad 1812 T/R; Manufacturer: Bourns; Approvals: CSA, TUV, UL; Power Dissipation: 800mW; Ratings: AEC-Q200, TUV; Value: 700mΩ; Trip Current: 300mA; Supplier: Farnell; Supplier Part Number: MF-MSMF010-2; Manufacturer Part Number: MF-MSMF010-2; RoHS: Compliant; Category: Fuses; Stock: 27107; Pricing: 5=0,528, 50=0,452, 250=0,38, 500=0,345, 1500=0,317, 3000=0,292 (EUR); Case/Package: 1812; Case Code (Imperial): 1812; Case Code (Metric): 4532; China RoHS: Compliant; Contact Plating: Gold; Current Rating: 40A; Export Control Classification Number (ECCN) Code: EAR99; Height: 1.1mm; Hold Current: 100mA; Harmonized Tariff Schedule (HTS) Code: 8533.40.80.70; Introduction Date: 2004-04-19; Lead Free: Lead Free; Length: 4.73mm; Lifecycle Status: Production; Max Current Rating: 40A; Max Operating Temperature: 85°C; Min Operating Temperature: -40°C; Mounting Technology: Surface Mount; Pins: 1812; Number of Terminals: 2; Operating Supply Voltage: 60V; Radiation Hardening: No; REACH SVHC: Unaffected; Schedule B: 8536100040, 8536100040|8536100040, 8536100040|8536100040|8536100040, 8536100040|8536100040|8536100040|8536100040; Terminal Material: Gold; Termination: SMD/SMT; Time to Trip: 1.5s; Voltage Rating: 60V; Voltage Rating (DC): 60V; Width: 3.41mm; Working Voltage: 60V; ComponentLink1URL: https://datasheet.octopart.com:443/MF-MSMF010-2-Bourns-datasheet-181955250.pdf?src-supplier=IHS; ComponentLink1Description: https://datasheet.octopart.com:443/MF-MSMF010-2-Bourns-datasheet-181955250.pdf?src-supplier=IHS; ComponentLink2URL: https://datasheet.octopart.com:443/MF-MSMF010-2-Bourns-datasheet-192480583.pdf?src-supplier=Electro+Sonic; ComponentLink2Description: https://datasheet.octopart.com:443/MF-MSMF010-2-Bourns-datasheet-192480583.pdf?src-supplier=Electro+Sonic; ComponentLink3URL: https://datasheet.octopart.com:443/MF-MSMF010-2-Bourns-datasheet-68302778.pdf?src-supplier=Electro+Sonic; ComponentLink3Description: https://datasheet.octopart.com:443/MF-MSMF010-2-Bourns-datasheet-68302778.pdf?src-supplier=Electro+Sonic; ComponentLink4URL: https://datasheet.octopart.com:443/MF-MSMF010-2-Bourns-datasheet-10413427.pdf?src-supplier=TME; ComponentLink4Description: https://datasheet.octopart.com:443/MF-MSMF010-2-Bourns-datasheet-10413427.pdf?src-supplier=TME; ComponentLink5URL: https://datasheet.octopart.com:443/MF-MSMF010-2-Bourns-datasheet-21630810.pdf?src-supplier=element14+APAC; ComponentLink5Description: https://datasheet.octopart.com:443/MF-MSMF010-2-Bourns-datasheet-21630810.pdf?src-supplier=element14+APAC; ComponentLink6URL: https://datasheet.octopart.com:443/MF-MSMF010-2-Bourns-datasheet-62100945.pdf?src-supplier=element14+APAC; ComponentLink6Description: https://datasheet.octopart.com:443/MF-MSMF010-2-Bourns-datasheet-62100945.pdf?src-supplier=element14+APAC; ComponentLink7URL: https://datasheet.octopart.com:443/MF-MSMF010-2-Bourns-datasheet-14703700.pdf?src-supplier=element14+APAC; ComponentLink7Description: https://datasheet.octopart.com:443/MF-MSMF010-2-Bourns-datasheet-14703700.pdf?src-supplier=element14+APAC; ComponentLink8URL: https://datasheet.octopart.com:443/MF-MSMF010-2.-Bourns-datasheet-66614317.pdf?src-supplier=element14+APAC; ComponentLink8Description: https://datasheet.octopart.com:443/MF-MSMF010-2.-Bourns-datasheet-66614317.pdf?src-supplier=element14+APAC; ComponentLink9URL: https://datasheet.octopart.com:443/MF-MSMF010-2-Bourns-datasheet-134530216.pdf?src-supplier=JRH+Electronics; ComponentLink9Description: https://datasheet.octopart.com:443/MF-MSMF010-2-Bourns-datasheet-134530216.pdf?src-supplier=JRH+Electronics; ComponentLink10URL: https://datasheet.octopart.com:443/MF-MSMF010-2-Bourns-datasheet-81453701.pdf?src-supplier=Newark; ComponentLink10Description: https://datasheet.octopart.com:443/MF-MSMF010-2-Bourns-datasheet-81453701.pdf?src-supplier=Newark; ComponentLink11URL: https://datasheet.octopart.com:443/MF-MSMF010-2-Bourns-datasheet-8700572.pdf?src-supplier=Factory+Futures; ComponentLink11Description: https://datasheet.octopart.com:443/MF-MSMF010-2-Bourns-datasheet-8700572.pdf?src-supplier=Factory+Futures; ComponentLink12URL: https://datasheet.octopart.com:443/MF-MSMF010-2-Bourns-datasheet-8482680.pdf?src-supplier=Factory+Futures; ComponentLink12Description: https://datasheet.octopart.com:443/MF-MSMF010-2-Bourns-datasheet-8482680.pdf?src-supplier=Factory+Futures; ComponentLink13URL: https://datasheet.octopart.com:443/MF-MSMF010-2-Bourns-datasheet-8399753.pdf?src-supplier=Verical; ComponentLink13Description: https://datasheet.octopart.com:443/MF-MSMF010-2-Bourns-datasheet-8399753.pdf?src-supplier=Verical; ComponentLink14URL: https://datasheet.octopart.com:443/MF-MSMF010-2-Bourns-datasheet-8366222.pdf?src-supplier=Verical; ComponentLink14Description: https://datasheet.octopart.com:443/MF-MSMF010-2-Bourns-datasheet-8366222.pdf?src-supplier=Verical; ComponentLink15URL: https://datasheet.octopart.com:443/MF-MSMF010-2-Bourns-datasheet-5321057.pdf?src-supplier=Verical; ComponentLink15Description: https://datasheet.octopart.com:443/MF-MSMF010-2-Bourns-datasheet-5321057.pdf?src-supplier=Verical; ComponentLink16URL: https://datasheet.octopart.com:443/MF-MSMF010-2-Bourns-datasheet-9622583.pdf?src-supplier=RS+(Formerly+Allied+Electronics); ComponentLink16Description: https://datasheet.octopart.com:443/MF-MSMF010-2-Bourns-datasheet-9622583.pdf?src-supplier=RS+(Formerly+Allied+Electronics); ComponentLink17URL: https://datasheet.octopart.com:443/MF-MSMF010-2-Bourns-datasheet-28695.pdf?src-supplier=RS+(Formerly+Allied+Electronics); ComponentLink17Description: https://datasheet.octopart.com:443/MF-MSMF010-2-Bourns-datasheet-28695.pdf?src-supplier=RS+(Formerly+Allied+Electronics); ComponentLink18URL: https://datasheet.octopart.com:443/MF-MSMF010-2-Bourns-datasheet-10475716.pdf?src-supplier=Jameco+(USA); ComponentLink18Description: https://datasheet.octopart.com:443/MF-MSMF010-2-Bourns-datasheet-10475716.pdf?src-supplier=Jameco+(USA); ComponentLink19URL: https://datasheet.octopart.com:443/MF-MSMF010-2-Bourns-datasheet-15141.pdf?src-supplier=Mouser; ComponentLink19Description: https://datasheet.octopart.com:443/MF-MSMF010-2-Bourns-datasheet-15141.pdf?src-supplier=Mouser; ComponentLink20URL: https://datasheet.octopart.com:443/MF-MSMF010-2-Bourns-datasheet-28511.pdf?src-supplier=DigiKey; ComponentLink20Description: https://datasheet.octopart.com:443/MF-MSMF010-2-Bourns-datasheet-28511.pdf?src-supplier=DigiKey; ComponentLink21URL: http://sigma.octopart.com:80/conflict_mineral_statement/Bourns-company-36.pdf?src-supplier=Compliance+Statements; ComponentLink21Description: http://sigma.octopart.com:80/conflict_mineral_statement/Bourns-company-36.pdf?src-supplier=Compliance+Statements
L1 = MLZ2012M6R8WT000: Inductor Power Shielded Multi-Layer 6.8uH 20% 2MHz Ferrite 0.4A 0.52Ohm DCR 0805 T/R; Manufacturer: TDK; Manufacturer Lifecycle Status: PRODUCTION; Manufacturer Package Identifier: 0805 (2012 metric); Current Rating: 400mA; DC Resistance (DCR): 520mΩ; Number of Circuits: 1; Saturation Current: 160mA; Self Resonant Frequency: 60MHz; Supplier: TME; Supplier Part Number: MLZ2012M6R8WT000; Manufacturer Part Number: MLZ2012M6R8WT000; RoHS: Compliant; Category: Fixed Inductors; Stock: 2000; Pricing: 2000=0,0336, 4000=0,0319, 6000=0,0316, 10000=0,0315, 20000=0,0312 (EUR); Case/Package: 0805; Case Code (Imperial): 0805; Case Code (Metric): 2012; Core Material: Ferrite; Height: 1.25mm; Height - Seated (Max): 1.4478mm; Value: 6.8µH; Length: 2mm; Lifecycle Status: Production; Max Current Rating: 400mA; Max Length: 2.2mm; Max Operating Temperature: 125°C; Max Width: 1.45mm; Min Length: 1.8mm; Min Operating Temperature: -55°C; Min Width: 1.05mm; Mounting Technology: Surface Mount; Number of Terminals: 2; Packaging: Digi-Reel®; REACH SVHC: Unaffected; RMS Current (Irms): 400mA; Schedule B: 8504500000, 8504500000|8504500000|8504500000|8504500000|8504500000; ESR: 520mΩ; Shielding: Shielded; Test Frequency: 2MHz; Tolerance: 20%; Width: 1.25mm; ComponentLink1URL: https://datasheet.octopart.com:443/MLZ2012M6R8WT000-TDK-datasheet-155380168.pdf?src-supplier=Future+Electronics; ComponentLink1Description: https://datasheet.octopart.com:443/MLZ2012M6R8WT000-TDK-datasheet-155380168.pdf?src-supplier=Future+Electronics; ComponentLink2URL: https://datasheet.octopart.com:443/MLZ2012M6R8WT000-TDK-datasheet-166125048.pdf?src-supplier=ODG+(Origin+Data+Global); ComponentLink2Description: https://datasheet.octopart.com:443/MLZ2012M6R8WT000-TDK-datasheet-166125048.pdf?src-supplier=ODG+(Origin+Data+Global); ComponentLink3URL: https://datasheet.octopart.com:443/MLZ2012M6R8WT000-TDK-datasheet-12356712.pdf?src-supplier=Newark; ComponentLink3Description: https://datasheet.octopart.com:443/MLZ2012M6R8WT000-TDK-datasheet-12356712.pdf?src-supplier=Newark; ComponentLink4URL: https://datasheet.octopart.com:443/MLZ2012M6R8WT000-TDK-datasheet-136874819.pdf?src-supplier=TME; ComponentLink4Description: https://datasheet.octopart.com:443/MLZ2012M6R8WT000-TDK-datasheet-136874819.pdf?src-supplier=TME
P1 = 691313510002: Strip Terminal Block, 20A, 1 Row(s), 1 Deck(s); NexarPartId: 8917759; Manufacturer: Wurth Elektronik; Voltage: 300V; Number of Positions Per Level: 2; Number of Levels: 1; Gender: Male; Pitch: 5.08mm; Lead Pitch: 5.08mm; Height: 8.7mm; Current: 20A; Length: 11.5mm; Max Operating Temperature: 105°C; RoHS: Compliant; Termination: Solder; Packaging: Box; Current Rating: 20A; Number of Pins: 2; Voltage Rating: 300V; Min Operating Temperature: -40°C; Color: Green; Width: 12.16mm; Mount: Through Hole; REACH SVHC: Unknown; Contact Plating: Tin; Number of Contacts: 2; Contact Material: Brass; Number of Rows: 1; Supplier: RS; Supplier Part Number: 1725184; Manufacturer Part Number: 691313510002; Category: Terminal Blocks; Stock: 596; Pricing: 50=0,299 (EUR); Mounting Technology: Through Hole; Pins: 2; ComponentLink1URL: https://datasheet.octopart.com:443/691313510002-W%C3%BCrth-Elektronik-Midcom-datasheet-10029069.pdf?src-supplier=Upverter; ComponentLink1Description: https://datasheet.octopart.com:443/691313510002-W%C3%BCrth-Elektronik-Midcom-datasheet-10029069.pdf?src-supplier=Upverter; ComponentLink2URL: https://datasheet.octopart.com:443/691313510002-W%C3%BCrth-Elektronik-datasheet-149525895.pdf?src-supplier=Farnell; ComponentLink2Description: https://datasheet.octopart.com:443/691313510002-W%C3%BCrth-Elektronik-datasheet-149525895.pdf?src-supplier=Farnell; ComponentLink3URL: https://datasheet.octopart.com:443/691313510002-W%C3%BCrth-Elektronik-datasheet-11475662.pdf?src-supplier=Farnell; ComponentLink3Description: https://datasheet.octopart.com:443/691313510002-W%C3%BCrth-Elektronik-datasheet-11475662.pdf?src-supplier=Farnell; ComponentLink4URL: https://datasheet.octopart.com:443/691313510002-W%C3%BCrth-Elektronik-Midcom-datasheet-5342250.pdf?src-supplier=Farnell; ComponentLink4Description: https://datasheet.octopart.com:443/691313510002-W%C3%BCrth-Elektronik-Midcom-datasheet-5342250.pdf?src-supplier=Farnell
R1 = RC0603JR-07560R: 0603 Res 560 Ω 5% 1/10W 75 V; Tolerance: 1%; Max Power Dissipation: 100mW; Temperature Coefficient: 100ppm/°C; Voltage Rating: 50V; Working Voltage: 75V; Value: 560; Manufacturer: *; Manufacturer Part Number: *; Power Rating: 1/10W; RoHS: YES; Supplier: TME; Supplier Part Number: RC0603JR-07560R; Category: Chip SMD Resistors; Stock: 10128; Pricing: 1=0,012, 10=0,0101, 25=0,00813, 50=0,00625, 100=0,00444, 500=0,00197, 1000=0,00155, 2500=0,00129, 5000=0,00125 (EUR); Case/Package: 0603; Case Code (Imperial): 0603; China RoHS: Non-Compliant; Composition: Thick Film; Contact Plating: Tin; Country of Origin: Mainland China, Taiwan; Depth: 800µm; Export Control Classification Number (ECCN) Code: EAR99; Features: Moisture Resistant; Height: 450µm; Harmonized Tariff Schedule (HTS) Code: 8533.21.00.30; Introduction Date: 2004-09-22; Lead Free: Lead Free; Length: 1.6mm; Lifecycle Status: Production; Max Operating Temperature: 155°C; Military Standard: Not; Min Operating Temperature: -55°C; Mounting Technology: Surface Mount; Pins: 2; Number of Terminals: 2; Number of Terminations: 2; Packaging: Cut Tape; Radiation Hardening: No; REACH SVHC: Unaffected; Schedule B: 8533210045, 8533210045|8533210045|8533210045|8533210045|8533210045; Termination: SMD/SMT; Voltage Rating (AC): 50V; Voltage Rating (DC): 50V; Width: 800µm; ComponentLink1URL: https://datasheet.octopart.com:443/RC0603JR-07560RL-Yageo-datasheet-175887523.pdf?src-supplier=Newark; ComponentLink1Description: https://datasheet.octopart.com:443/RC0603JR-07560RL-Yageo-datasheet-175887523.pdf?src-supplier=Newark; ComponentLink2URL: https://datasheet.octopart.com:443/RC0603JR-07560RL-Yageo-datasheet-8328172.pdf?src-supplier=Newark; ComponentLink2Description: https://datasheet.octopart.com:443/RC0603JR-07560RL-Yageo-datasheet-8328172.pdf?src-supplier=Newark; ComponentLink3URL: https://datasheet.octopart.com:443/RC0603JR-07560RL-Yageo-datasheet-34211833.pdf?src-supplier=Newark; ComponentLink3Description: https://datasheet.octopart.com:443/RC0603JR-07560RL-Yageo-datasheet-34211833.pdf?src-supplier=Newark; ComponentLink4URL: https://datasheet.octopart.com:443/RC0603JR-07560RL-Yageo-datasheet-79472498.pdf?src-supplier=Upverter; ComponentLink4Description: https://datasheet.octopart.com:443/RC0603JR-07560RL-Yageo-datasheet-79472498.pdf?src-supplier=Upverter; ComponentLink5URL: https://datasheet.octopart.com:443/RC0603JR-07560RL-Yageo-Group-datasheet-190305687.pdf?src-supplier=Future+Electronics; ComponentLink5Description: https://datasheet.octopart.com:443/RC0603JR-07560RL-Yageo-Group-datasheet-190305687.pdf?src-supplier=Future+Electronics; ComponentLink6URL: https://datasheet.octopart.com:443/RC0603JR-07560RL-Yageo-datasheet-164759695.pdf?src-supplier=Future+Electronics; ComponentLink6Description: https://datasheet.octopart.com:443/RC0603JR-07560RL-Yageo-datasheet-164759695.pdf?src-supplier=Future+Electronics; ComponentLink7URL: https://datasheet.octopart.com:443/RC0603JR-07560RL-Yageo-datasheet-137700087.pdf?src-supplier=Future+Electronics; ComponentLink7Description: https://datasheet.octopart.com:443/RC0603JR-07560RL-Yageo-datasheet-137700087.pdf?src-supplier=Future+Electronics; ComponentLink8URL: https://datasheet.octopart.com:443/RC0603JR07560RL-Yageo-datasheet-27584510.pdf?src-supplier=Future+Electronics; ComponentLink8Description: https://datasheet.octopart.com:443/RC0603JR07560RL-Yageo-datasheet-27584510.pdf?src-supplier=Future+Electronics; ComponentLink9URL: https://datasheet.octopart.com:443/RC0603JR-07560RL-Yageo-datasheet-15599030.pdf?src-supplier=Future+Electronics; ComponentLink9Description: https://datasheet.octopart.com:443/RC0603JR-07560RL-Yageo-datasheet-15599030.pdf?src-supplier=Future+Electronics; ComponentLink10URL: https://datasheet.octopart.com:443/RC0603JR-07560RL-Yageo-datasheet-12596169.pdf?src-supplier=Future+Electronics; ComponentLink10Description: https://datasheet.octopart.com:443/RC0603JR-07560RL-Yageo-datasheet-12596169.pdf?src-supplier=Future+Electronics; ComponentLink11URL: https://datasheet.octopart.com:443/RC0603JR-07560RL-Yageo-datasheet-8324193.pdf?src-supplier=Future+Electronics; ComponentLink11Description: https://datasheet.octopart.com:443/RC0603JR-07560RL-Yageo-datasheet-8324193.pdf?src-supplier=Future+Electronics; ComponentLink12URL: https://datasheet.octopart.com:443/RC0603JR-07560RL-Yageo-datasheet-62067350.pdf?src-supplier=element14+APAC; ComponentLink12Description: https://datasheet.octopart.com:443/RC0603JR-07560RL-Yageo-datasheet-62067350.pdf?src-supplier=element14+APAC; ComponentLink13URL: https://datasheet.octopart.com:443/RC0603JR-07560RL-Yageo-Group-datasheet-189192902.pdf?src-supplier=LCSC; ComponentLink13Description: https://datasheet.octopart.com:443/RC0603JR-07560RL-Yageo-Group-datasheet-189192902.pdf?src-supplier=LCSC; ComponentLink14URL: https://datasheet.octopart.com/RC0603JR-07560RL-Yageo-datasheet-73766026.pdf; ComponentLink14Description: https://datasheet.octopart.com/RC0603JR-07560RL-Yageo-datasheet-73766026.pdf; ComponentLink15URL: https://datasheet.octopart.com:443/RC0603JR-07560RL-Yageo-datasheet-118562.pdf?src-supplier=DigiKey; ComponentLink15Description: https://datasheet.octopart.com:443/RC0603JR-07560RL-Yageo-datasheet-118562.pdf?src-supplier=DigiKey; ComponentLink16URL: http://sigma.octopart.com:80/conflict_mineral_statement/Yageo-company-3.pdf?src-supplier=Compliance+Statements; ComponentLink16Description: http://sigma.octopart.com:80/conflict_mineral_statement/Yageo-company-3.pdf?src-supplier=Compliance+Statements; ComponentLink17URL: http://sigma.octopart.com:80/rohs_statement/Yageo-company-2.pdf?src-supplier=Compliance+Statements; ComponentLink17Description: http://sigma.octopart.com:80/rohs_statement/Yageo-company-2.pdf?src-supplier=Compliance+Statements